# EAGLE design fireshield (EAGLE 7.5.0)
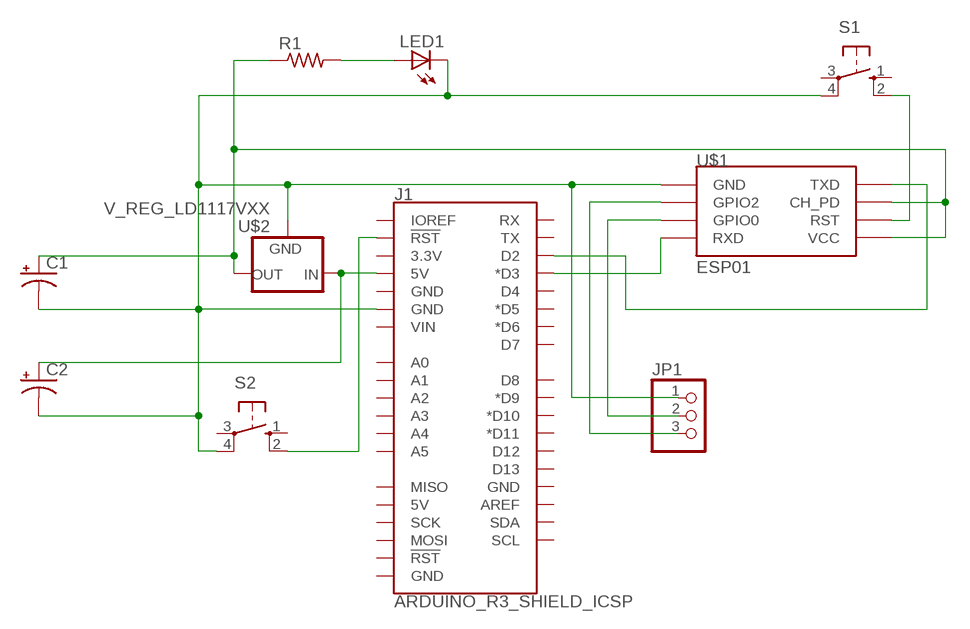
[diagram p0: schematic, sheet 1]

## Parts
C1  10UF-25V-20%(PTH)KIT  [CPOL-RADIAL-10UF-25V-KIT]
C2  10UF-25V-20%(PTH)KIT  [CPOL-RADIAL-10UF-25V-KIT]
J1  ARDUINO_R3_SHIELD_ICSP  [UNO_R3_SHIELD_ICSP]
JP1  PINHD-1X3  [1X03]
LED1  LED3MM  [LED3MM]
R1  R-US_0207/10  [0207/10]
S1  10-XX  [B3F-10XX]
S2  10-XX  [B3F-10XX]
U$1  ESP01  [ESP01]
U$2  V_REG_LD1117VXX  [78XXL]

## Nets
N$1: C1.2(-) C2.2(-) J1.GND@1(GND) JP1.1 LED1.K(C) S1.4(P1) S2.4(P1) U$1.GND U$2.IN(GND)
N$2: J1.D3(*D3) U$1.RX(RXD)
N$3: C2.1(+) J1.5V U$2.OUT(IN)
N$4: C1.1(+) R1.1 U$1.CH_PD U$1.VCC U$2.GND(OUT)
N$5: J1.D2 U$1.TX(TXD)
N$6: S1.2(S1) U$1.RST
N$7: LED1.A R1.2
N$8: J1.RES(!RST!) S2.2(S1)
N$9: JP1.3 U$1.GPIO2
N$10: JP1.2 U$1.GPIO0
Unconnected: J1.3.3V J1.5V_ICSP(5V) J1.A0 J1.A1 J1.A2 J1.A3 J1.A4 J1.A5 J1.AREF J1.D4 J1.D5(*D5) J1.D6(*D6) J1.D7 J1.D8 J1.D9(*D9) J1.D10(*D10) J1.D11(*D11) J1.D12 J1.D13 J1.GND@0(GND) J1.GND@2(GND) J1.GND_ICSP(GND) J1.IOREF J1.MISO J1.MOSI J1.RST_ICSP(!RST!) J1.RX J1.SCK J1.SCL J1.SDA J1.TX J1.VIN S1.1(S) S1.3(P) S2.1(S) S2.3(P)

## Library data of the parts
C1 C2 = SparkFun-Capacitors:10UF-25V-20%(PTH): CAP-08440; PROD_ID: CAP-08440
J1 = SparkFun-Boards:ARDUINO_R3_SHIELD_ICSP: Arduino R3 Shield Footprint w/ 6-pin (2x3) ICSP Header
JP1 = adafruit:PINHD-1X3: PIN HEADER
LED1 = adafruit:LED: LED OSRAM: - CHIPLED LG R971, LG N971, LY N971, LG Q971, LY Q971, LO R971, LY R971 LH N974, LH R974 LS Q976, LO Q976, LY Q976 LO Q996 - Hyper CHIPLED LW Q18S LB Q993, LB Q99A, LB R99A - SideLED LS A670, LO A670, LY A670, LG A670, LP A670 LB A673, LV A673, LT A673, LW A673 LH A674 LY A675 LS A676, LA A676, LO A676, LY A676, LW A676 LS A679, LY A679, LG A679 - Hyper Micro SIDELED® LS Y876, LA Y876, LO Y876, LY Y876 LT Y87S - SmartLED LW L88C, LW L88S LB L89C, LB L89S, LG L890 LS L89K, LO L89K, LY L89K LS L896, LA L896, LO L896, LY L896 - TOPLED LS T670, LO T670, LY T670, LG T670, LP T670 LSG T670, LSP T670, LSY T670, LOP T670, LYG T670 LG T671, LOG T671, LSG T671 LB T673, LV T673, LT T673, LW T673 LH T674 LS T676, LA T676, LO T676, LY T676, LB T676, LH T676, LSB T676, LW T676 LB T67C, LV T67C, LT T67C, LS T67K, LO T67K, LY T67K, LW E67C LS E67B, LA E67B, LO E67B, LY E67B, LB E67C, LV E67C, LT E67C LW T67C LS T679, LY T679, LG T679 LS T770, LO T770, LY T770, LG T770, LP T770 LB T773, LV T773, LT T773, LW T773 LH T774 LS E675, LA E675, LY E675, LS T675 LS T776, LA T776, LO T776, LY T776, LB T776 LHGB T686 LT T68C, LB T68C - Hyper Mini TOPLED® LB M676 - Mini TOPLED Santana® LG M470 LS M47K, LO M47K, LY M47K Source: http://www.osram.convergy.de/
R1 = adafruit:R-US_: RESISTOR, American symbol
S1 S2 = switch-omron:10-XX: OMRON SWITCH; MPN: B3F-1000; OC_FARNELL: 176432; OC_NEWARK: 36M3542
U$1 = esp8266modules:ESP01: ESP8266 Wifi module 01
U$2 = SparkFun-PowerIC:V_REG_LD1117VXX: LD1117VXX voltage regulator. We carry the 3.3V version (COM-00526) in TO-220 package.

## Board
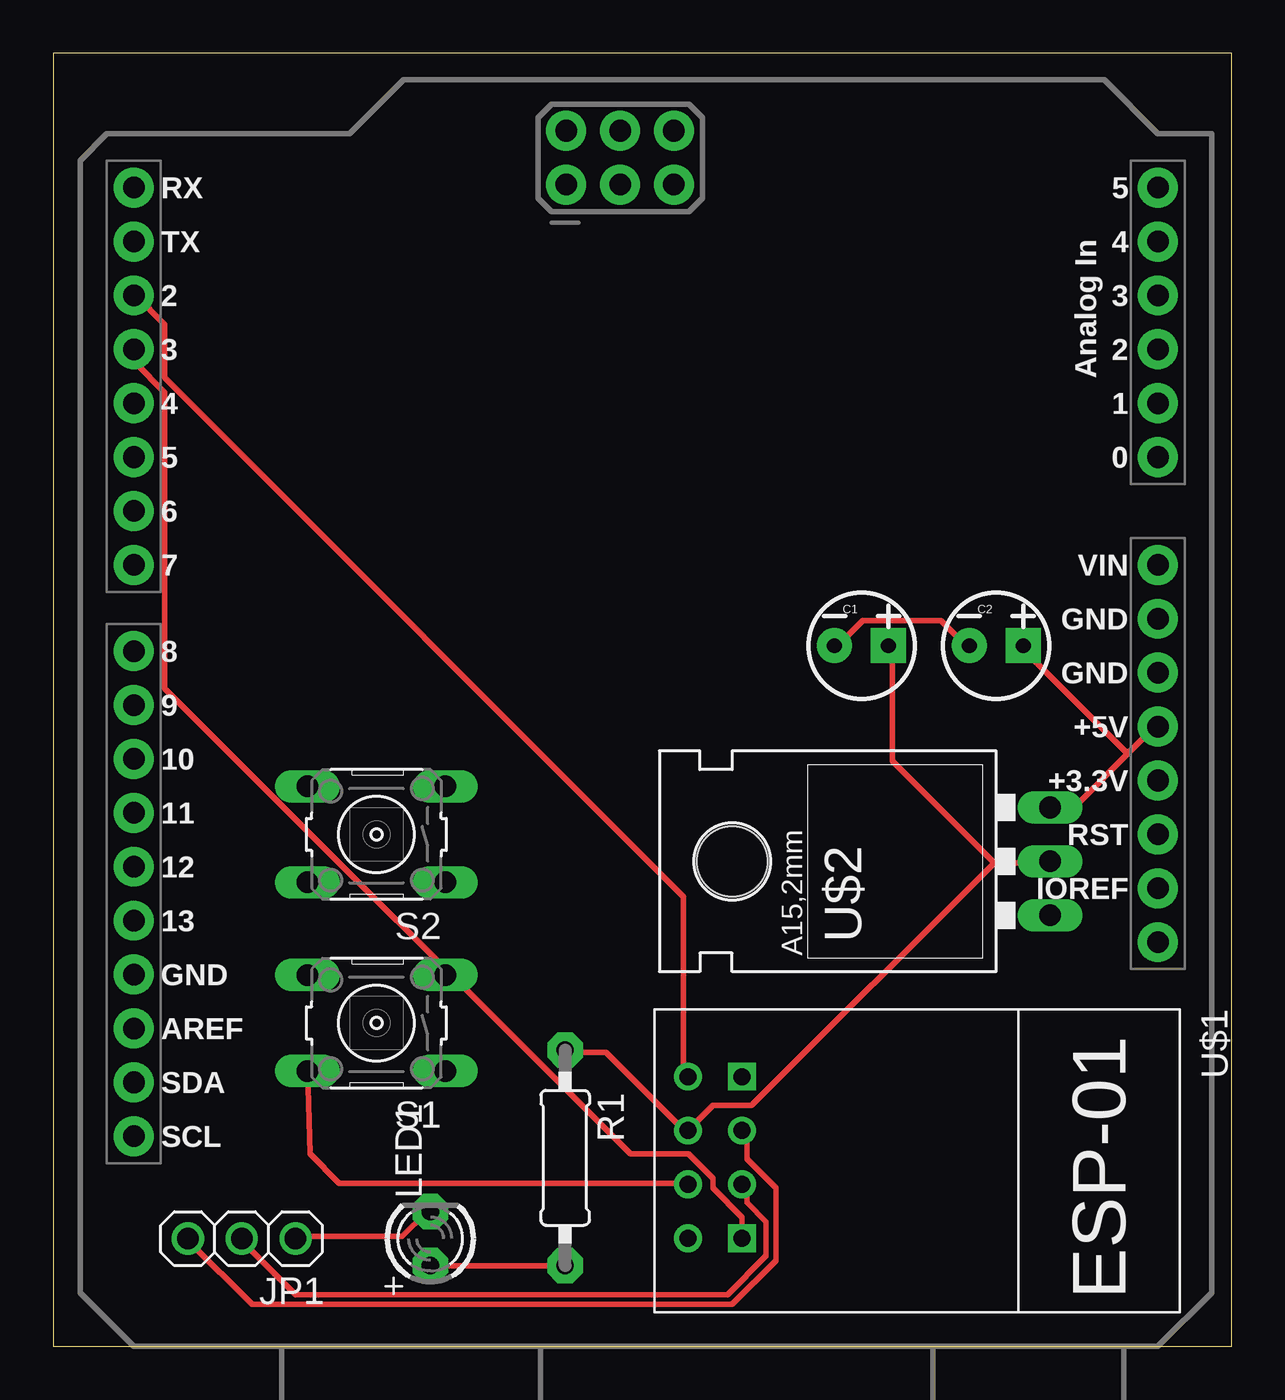
[diagram p1: board, top side]
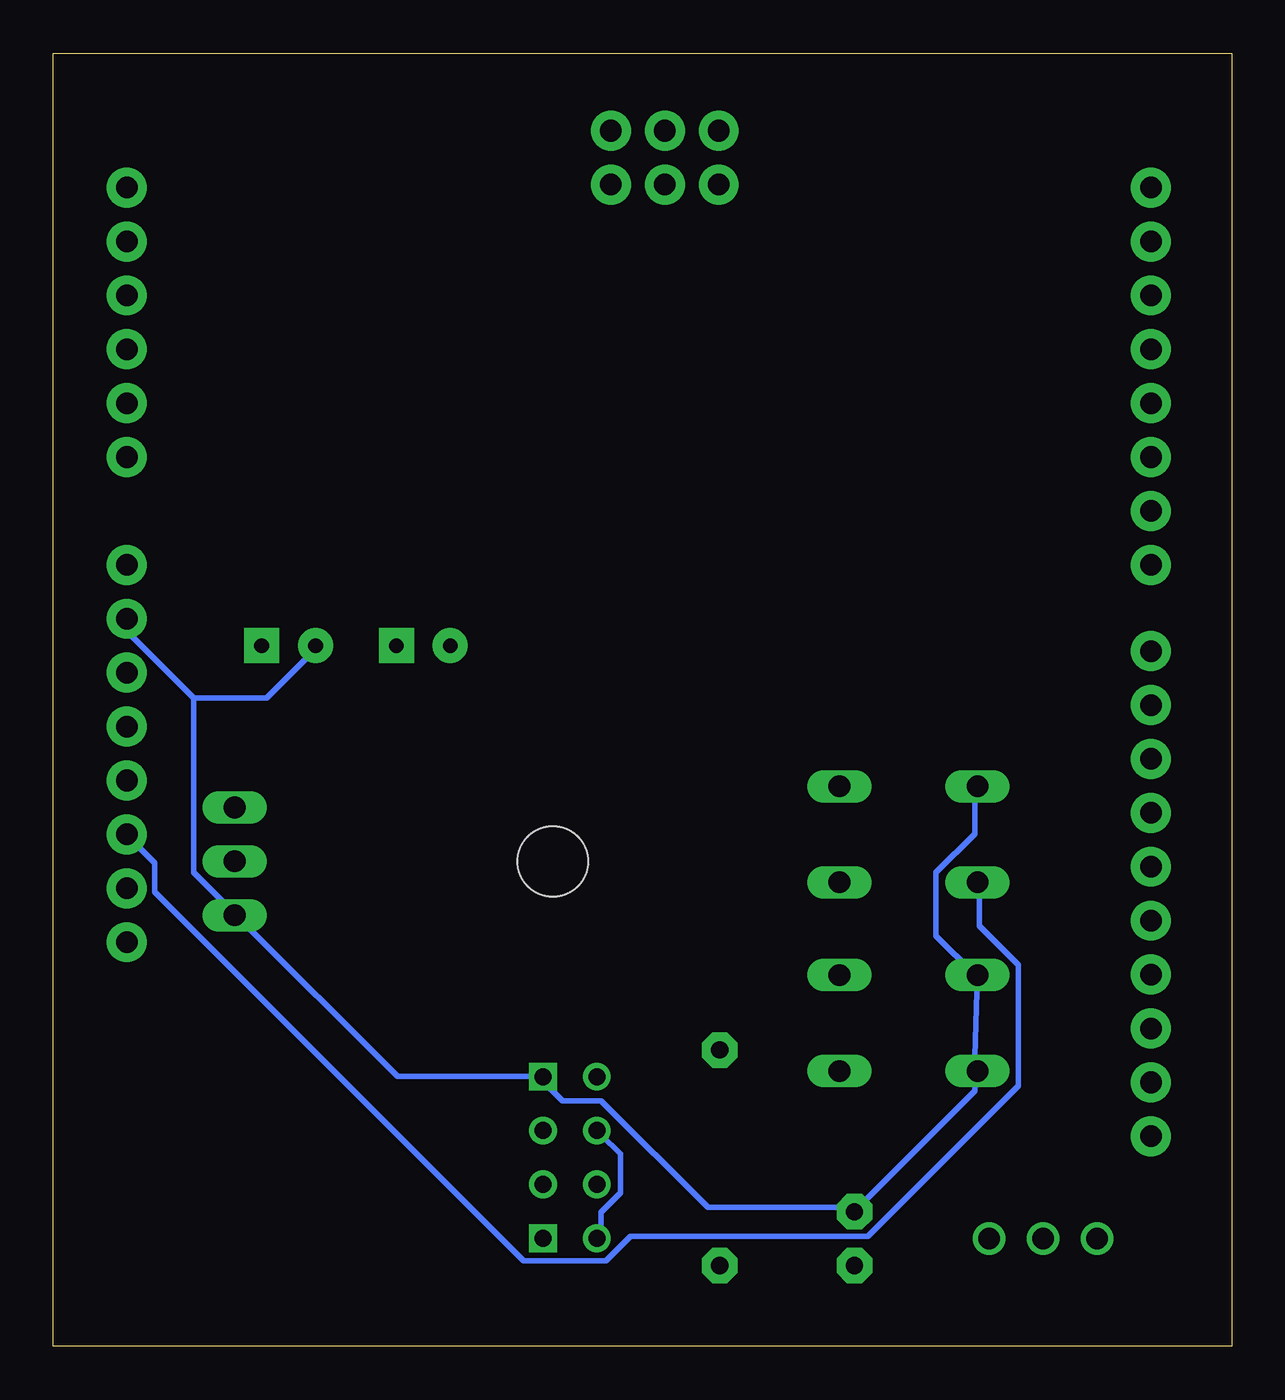
[diagram p2: board, bottom side, seen from below]

Size 55.55 x 60.95 mm. Coordinates in mm from the lower left corner, seen from the top.
Outline: 0,0 55.55,0 55.55,60.95 0,60.95 0,0
Copper layers (1*16): Top 0.035mm / dielectric 1.5mm / Bottom 0.035mm
Design rules "default": minimum track width 10mil, minimum drill 24mil, track to track 8mil, track to pad 8mil, pad to pad 8mil, via to via 8mil, smd to smd 8mil, copper to edge 40mil, drill to drill 8mil, minimum pad ring 10mil, minimum via ring 8mil, stop-mask expansion 4mil, vias tented up to drill 0mil, thermal gap 10mil

### Footprints (pad centres in the part's own frame; a part is rotated, then mirrored left to right if it is on the bottom)
CPOL-RADIAL-10UF-25V-KIT = drill 0.7 pad 1.651 square: 1 1.27,0 | drill 0.7 pad 1.651: 2 -1.27,0
UNO_R3_SHIELD_ICSP = drill 1.016 pad 1.88: 3.3V 50.8,26.67; 5V 50.8,29.21; 5V_ICSP 22.91,57.29; A0 50.8,41.91; A1 50.8,44.45; A2 50.8,46.99; A3 50.8,49.53; A4 50.8,52.07; A5 50.8,54.61; AREF 2.54,14.986; D2 2.54,49.53; D3 2.54,46.99; D4 2.54,44.45; D5 2.54,41.91; D6 2.54,39.37; D7 2.54,36.83; D8 2.54,32.766; D9 2.54,30.226; D10 2.54,27.686; D11 2.54,25.146; D12 2.54,22.606; D13 2.54,20.066; GND@0 50.8,31.75; GND@1 50.8,34.29; GND@2 2.54,17.526; GND_ICSP 27.99,57.29; IOREF 50.8,21.59; MISO 22.91,54.75; MOSI 25.45,57.29; NC 50.8,19.05; RES 50.8,24.13; RST_ICSP 27.99,54.75; RX 2.54,54.61; SCK 25.45,54.75; SCL 2.54,9.906; SDA 2.54,12.446; TX 2.54,52.07; VIN 50.8,36.83
1X03 = drill 1.016: 1 -2.54,0; 2 0,0; 3 2.54,0
LED3MM = drill 0.813 pad 1.676 octagon: A -1.27,0; K 1.27,0
0207/10 = drill 0.813 pad 1.676 octagon: 1 -5.08,0; 2 5.08,0
B3F-10XX = drill 1.016 long: 1 -3.251,2.261; 2 3.251,2.261; 3 -3.251,-2.261; 4 3.251,-2.261
ESP01 = drill 0.8: CH_PD -1.285,-8.178; GPIO0 1.255,-5.638; GPIO2 -1.285,-5.638; RST 1.255,-8.178; TX -3.825,-8.178; VCC 3.795,-8.178 | drill 0.8 square: GND -3.825,-5.638; RX 3.795,-5.638
78XXL = drill 1.016 long: GND 0,-3.81; IN -2.54,-3.81; OUT 2.54,-3.81 | hole 3.302: 0,11.176

### Placement (x,y rotation side)
C1  38.1,33.02 0 top
C2  44.45,33.02 0 top
J1  1.27,0 0 top
JP1  8.89,5.08 180 top
LED1  17.78,5.08 90 top
R1  24.13,8.89 270 top
S1  15.24,15.24 180 top
S2  15.24,24.13 180 top
U$1  38.1,8.89 270 top
U$2  43.18,22.86 90 top

### Tracks (layer width: path | path; a pad name or v marks a point on that pad's centre or on a via)
N$1
  Top 0.254: JP1.1 11.43,5.18 16.46,5.18 17.6,6.32 LED1.K | C1.2 37.03,33.07 38.18,34.21 41.83,34.21 42.98,33.07 C2.2
  Bottom 0.254: 48.92,30.56 51.89,33.53 51.89,34.21 J1.GND@1 | 48.92,30.56 48.92,22.33 47.09,20.5 U$2.IN 46.86,20.27 39.32,12.72 32.69,12.72 U$1.GND 32.46,12.5 31.55,11.58 29.72,11.58 24.69,6.55 17.83,6.55 LED1.K 17.6,6.55 12.12,12.04 12.12,13.64 S1.4 12.12,17.53 13.95,19.36 13.95,22.33 12.12,24.15 12.12,26.21 S2.4 | 48.92,30.56 45.49,30.56 43.2,32.84 C2.2
N$2
  Top 0.254: U$1.RX 32.46,5.18 32.46,6.1 31.09,7.47 31.09,7.93 29.95,9.07 27.2,9.07 5.26,31.01 5.26,44.96 3.89,46.33 3.89,46.79 J1.D3
N$3
  Top 0.254: 50.75,28.04 51.89,29.18 J1.5V | 50.75,28.04 48.23,25.53 47.09,25.53 U$2.OUT | 50.75,28.04 50.52,28.04 45.72,32.84 C2.1
N$4
  Top 0.254: 44.35,22.78 46.86,22.78 U$2.GND | 44.35,22.78 32.92,11.35 31.09,11.35 29.95,10.21 U$1.CH_PD 29.72,10.21 26.06,13.87 24.23,13.87 R1.1 | 44.35,22.78 39.55,27.58 39.55,32.84 C1.1
  Bottom 0.254: U$1.VCC 29.72,5.18 29.72,6.32 28.8,7.24 28.8,9.07 29.72,9.98 U$1.CH_PD
N$5
  Top 0.254: U$1.TX 29.72,12.72 29.72,21.18 5.26,45.64 5.26,48.16 3.89,49.53 J1.D2
N$6
  Top 0.254: U$1.RST 29.72,7.7 13.49,7.7 12.12,9.07 S1.2
N$7
  Top 0.254: R1.2 LED1.A
N$8
  Bottom 0.254: S2.2 11.89,21.87 11.89,19.81 10.06,17.98 10.06,12.27 17.14,5.18 28.35,5.18 29.49,4.04 33.38,4.04 50.75,21.41 50.75,22.78 51.89,23.93 J1.RES
N$9
  Top 0.254: U$1.GPIO2 32.69,9.98 32.69,8.84 34.06,7.47 34.06,4.04 32,1.98 9.37,1.98 6.4,4.95 JP1.3
N$10
  Top 0.254: U$1.GPIO0 32.69,7.47 32.69,6.78 33.6,5.87 33.6,4.27 31.77,2.44 11.43,2.44 8.91,4.95 JP1.2